# EasyEDA Pro project VTOL_V1 (3).eprj

# Schematic Schematic1
Board Name: FC-V1; Create Date: 2025-10-27; Page Name: P1; Project Name: VTOL_V1 (3); Schematic Name: Schematic1; Update Date: 2026-02-03; Company: EasyEDA.com; Page Size: A4; Version: V1.0
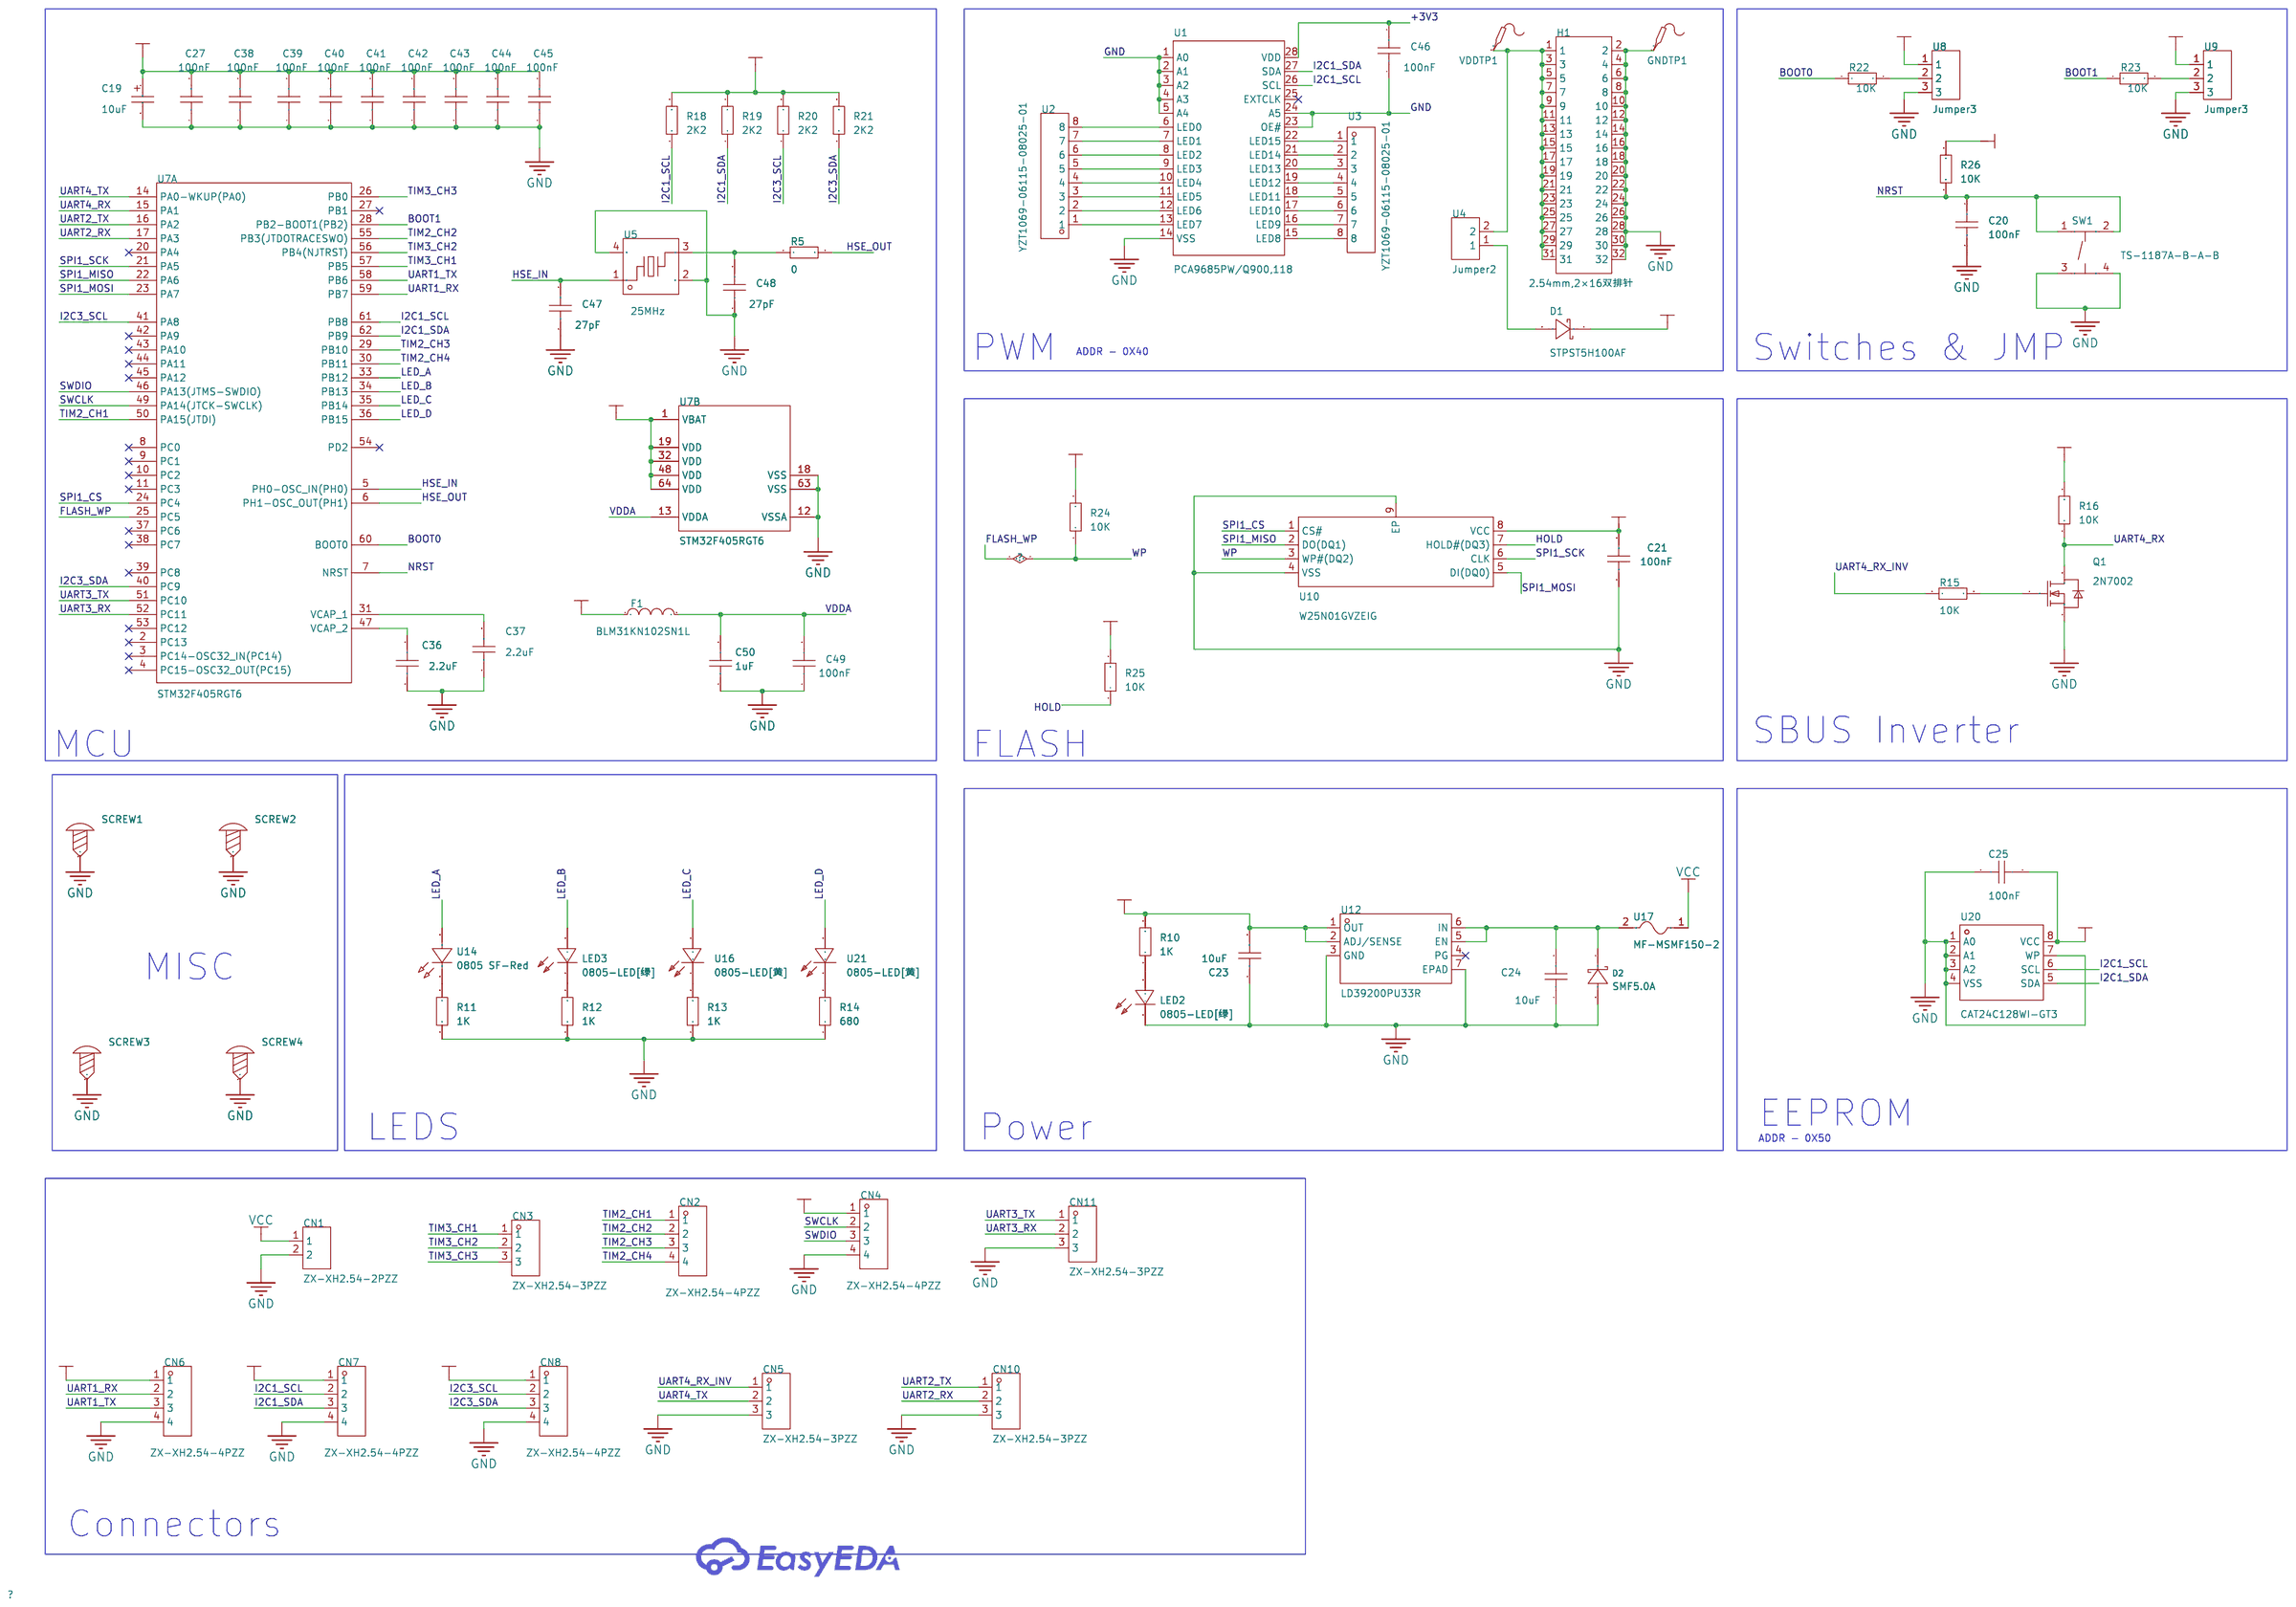
[diagram p0: schematic sheet]

## Parts
C19  10uF  [CASE-B_3528]
C20  100nF  [C0603]
C21  100nF  [C0805]
C23  10uF  [C0805]
C24  10uF  [C0805]
C25  100nF  [C0805]
C27  100nF  [C0603]
C36  2.2uF  [C0603]
C37  2.2uF  [C0603]
C38  100nF  [C0603]
C39  100nF  [C0603]
C40  100nF  [C0603]
C41  100nF  [C0603]
C42  100nF  [C0603]
C43  100nF  [C0603]
C44  100nF  [C0603]
C45  100nF  [C0603]
C46  100nF  [C0603]
C47  27pF  [C0603]
C48  27pF  [C0603]
C49  100nF  [C0603]
C50  1uF  [C0603]
CN1  ZX-XH2.54-2PZZ  [CONN-TH_2P-P2.50_HX25003-2A]
CN2  ZX-XH2.54-4PZZ  [CONN-TH_4P-P2.50_4PIN]
CN3  ZX-XH2.54-3PZZ  [CONN-TH_3P-P2.54_2501S-3P]
CN4  ZX-XH2.54-4PZZ  [CONN-TH_4P-P2.50_4PIN]
CN5  ZX-XH2.54-3PZZ  [CONN-TH_3P-P2.54_2501S-3P]
CN6  ZX-XH2.54-4PZZ  [CONN-TH_4P-P2.50_4PIN]
CN7  ZX-XH2.54-4PZZ  [CONN-TH_4P-P2.50_4PIN]
CN8  ZX-XH2.54-4PZZ  [CONN-TH_4P-P2.50_4PIN]
CN10  ZX-XH2.54-3PZZ  [CONN-TH_3P-P2.54_2501S-3P]
CN11  ZX-XH2.54-3PZZ  [CONN-TH_3P-P2.54_2501S-3P]
D1  STPST5H100AF  [SOD-128_L3.8-W2.4-LS4.7-RD]
D2  SMF5.0A  [SOD-123FL_L2.8-W1.8-LS3.7-RD]
F1  BLM31KN102SN1L  [L1206]
GNDTP1  -  [Test-Point-0.5mm]
H1  2.54mm,2×16双排针  [HDR-TH_32P-P2.54-V-M-R2-C16-S2.54]
LED2  0805-LED[绿]  [LED0805-RD_GREEN]
LED3  0805-LED[绿]  [LED0805-RD_GREEN]
Q1  2N7002  [SOT-23-3_L2.9-W1.3-P1.90-LS2.4-BR]
R5  0  [R0603]
R10  1K  [R0603]
R11  1K  [R0603]
R12  1K  [R0603]
R13  1K  [R0603]
R14  680  [R0603]
R15  10K  [R0603]
R16  10K  [R0603]
R18  2K2  [R0603]
R19  2K2  [R0603]
R20  2K2  [R0603]
R21  2K2  [R0603]
R22  10K  [R0603]
R23  10K  [R0603]
R24  10K  [R0603]
R25  10K  [R0603]
R26  10K  [R0603]
SCREW1  -  [Screw-Hole-M4]
SCREW2  -  [Screw-Hole-M4]
SCREW3  -  [Screw-Hole-M4]
SCREW4  -  [Screw-Hole-M4]
SW1  TS-1187A-B-A-B  [SW-SMD_4P-L5.1-W5.1-P3.70-LS6.5-TL_H1.5]
U1  PCA9685PW/Q900,118  [TSSOP-28_L9.7-W4.4-P0.65-LS6.4-BL]
U2  YZT1069-06115-08025-01  [HDR-TH_8P-P2.54-V-M]
U3  YZT1069-06115-08025-01  [HDR-TH_8P-P2.54-V-M]
U4  Jumper2  [HDR-TH_2P-P2.54-V-M-1]
U5  25MHz  [CRYSTAL-SMD_4P-L3.2-W2.5-BL]
U7  STM32F405RGT6  [LQFP-64_L10.0-W10.0-P0.50-LS12.0-BL]  (sections 1,2)
U8  Jumper3  [HDR-TH_3P-P2.54-V-M-A]
U9  Jumper3  [HDR-TH_3P-P2.54-V-M-A]
U10  W25N01GVZEIG  [WSON-8_L8.0-W6.10-P1.27-BL-EP]
U12  LD39200PU33R  [DFN-6_L3.0-W3.0-P0.95-BL-EP]
U14  0805 SF-Red  [LED0805-RD_RED]
U16  0805-LED[黄]  [LED0805-RD_YELLOW]
U17  MF-MSMF150-2  [F1812]
U20  CAT24C128WI-GT3  [SOIC-8_L4.9-W3.9-P1.27-LS6.0-BL]
U21  0805-LED[黄]  [LED0805-RD_YELLOW]
VDDTP1  -  [Test-Point-0.5mm]

## Library data of the parts
C19 = TAJB107K006RNJ: LCSC Part Name: 100uF ±10% 6.3V; Supplier Part: C16133; Manufacturer: Kyocera AVX; Supplier Footprint: CASE-B-3528-21(mm); JLCPCB Part Class: Basic Part; Supplier: LCSC; Tolerance: ±10%; Voltage Rating: 6.3V; Equivalent Series Resistance(ESR): 1.7Ω@100kHz; Operating Temperature: -55℃~+125℃
C20 = CAP_0603: Supplier Footprint: 0603
C21 C23-C25 = CC0805KRX7R9BB104: LCSC Part Name: 100nF ±10% 50V; Supplier Part: C49678; Manufacturer: YAGEO(国巨); Supplier Footprint: 0805; JLCPCB Part Class: Basic Part; Datasheet: https://item.szlcsc.com/datasheet/CC0805KRX7R9BB104/50686.html; Supplier: LCSC; Tolerance: ±10%; Voltage Rating: 50V; Temperature Coefficient: X7R
C27 C36-C50 = 0603B822K500CT: LCSC Part Name: 8.2nF ±10% 50V; Supplier Part: C296038; Manufacturer: Walsin(华新科); Supplier Footprint: 0603; JLCPCB Part Class: Extended Part; Datasheet: https://atta.szlcsc.com/upload/public/pdf/source/20180926/C296038_4FE3499E3C180C182923164F56DD8F14.pdf; Supplier: LCSC
CN1 = ZX-XH2.54-2PZZ: LCSC Part Name: 1x2P 间距:2.5mm 直插 系列:XH; Supplier Part: C7429632; Manufacturer: Megastar(兆星); Supplier Footprint: 插件,P=2.5mm; JLCPCB Part Class: Extended Part; Datasheet: https://item.szlcsc.com/datasheet/ZX-XH2.54-2PZZ/8427549.html; Supplier: LCSC; Pins Structure: 1x2P; Pitch: 2.5mm; Mounting Type: Through Hole; Reference Series: XH; Number of Pins: 2P; Number of Rows: 1; Number of PINs Per Row: 2; Current Rating: 2A; Contact Material: Brass; Contact Plating: Tin; Operating Temperature: -25℃~+85℃; Voltage Rating: 250V; Plastic Material: PA66; Flame Retardant Rating: UL94V-0; Color: White; Z-Height of the Board: 7mm; X-Length of Bottom Edge on Board (Spacing Line): 7.5mm; Y-Width of Bottom Edge on Board: 5.9mm
CN2 CN4 CN6-CN8 = ZX-XH2.54-4PZZ: LCSC Part Name: 1x4P 间距:2.5mm 直插 系列:XH; Supplier Part: C7429634; Manufacturer: Megastar(兆星); Supplier Footprint: 插件,P=2.5mm; JLCPCB Part Class: Extended Part; Datasheet: https://item.szlcsc.com/datasheet/ZX-XH2.54-4PZZ/8427551.html; Supplier: LCSC; Pins Structure: 1x4P; Pitch: 2.5mm; Mounting Type: Through Hole; Reference Series: XH; Number of Pins: 4P; Number of Rows: 1; Number of PINs Per Row: 4; Current Rating: 3A; Contact Material: Brass; Contact Plating: Tin; Operating Temperature: -25℃~+85℃; Voltage Rating: 250V; Plastic Material: PA66; Flame Retardant Rating: UL94V-0; Color: White; Z-Height of the Board: 7mm; X-Length of Bottom Edge on Board (Spacing Line): 12.5mm; Y-Width of Bottom Edge on Board: 5.9mm
CN3 CN5 CN10 CN11 = ZX-XH2.54-3PZZ: LCSC Part Name: 1x3P 间距:2.5mm 直插 系列:XH; Supplier Part: C7429633; Manufacturer: Megastar(兆星); Supplier Footprint: 插件,P=2.5mm; JLCPCB Part Class: Extended Part; Datasheet: https://item.szlcsc.com/datasheet/ZX-XH2.54-3PZZ/8427550.html; Supplier: LCSC; Pins Structure: 1x3P; Pitch: 2.5mm; Mounting Type: Through Hole; Reference Series: XH; Number of Pins: 3P; Number of Rows: 1; Number of PINs Per Row: 3; Current Rating: 3A; Contact Material: Brass; Contact Plating: Tin; Operating Temperature: -25℃~+85℃; Voltage Rating: 250V; Plastic Material: PA66; Flame Retardant Rating: UL94V-0; Color: White; Z-Height of the Board: 7mm; X-Length of Bottom Edge on Board (Spacing Line): 10mm; Y-Width of Bottom Edge on Board: 5.9mm
D1 = STPST5H100AF: LCSC Part Name: 电压:100V 电流:5A; Supplier Part: C20033894; Manufacturer: ST(意法半导体); Supplier Footprint: SOD-128FLAT; JLCPCB Part Class: Extended Part; Datasheet: https://item.szlcsc.com/datasheet/STPST5H100AF/21362038.html; Supplier: LCSC; Voltage - Forward(Vf@If): 680mV@5A; Voltage - DC Reverse(Vr): 100V; Current - Rectified: 5A; Reverse Leakage Current (Ir): 11.5uA@100V; Non-Repetitive Peak Forward Surge Current: 75A
D2 = SMF5.0A_C5116418: LCSC Part Name: 单向TVS 5V截止 峰值浪涌电流：21.7A@10/1000us; Supplier Part: C5116418; Manufacturer: SHIKUES(时科); Supplier Footprint: SOD-123FL; JLCPCB Part Class: Extended Part; Datasheet: https://item.szlcsc.com/datasheet/SMF5.0A/5692159.html; Supplier: LCSC; Polarity: Unidirectional; Reverse Stand-Off Voltage (Vrwm): 5V; Clamping Voltage: 9.2V; Peak Pulse Current (Ipp): 21.7A@10/1000us; Peak Pulse Power Dissipation (Ppp): 200W@10/1000us; Voltage - Breakdown: 7V; Reverse Leakage Current (Ir): 400uA; Operating Temperature: -55℃~+150℃; Type: TVS
F1 = BLM31KN102SN1L: LCSC Part Name: 单路 1206磁珠 阻抗1kΩ@100MHz; Supplier Part: C560056; Manufacturer: muRata(村田); Supplier Footprint: 1206; JLCPCB Part Class: Extended Part; Datasheet: https://atta.szlcsc.com/upload/public/pdf/source/20210621/C710520_4F6DB98DF5CB55CC9352379DA233A10A.pdf; Supplier: LCSC; Impedance @ Frequency: 1kΩ@100MHz; DC Resistance: 75mΩ; Current Rating: 2A; Circuits: 1
GNDTP1 VDDTP1 = Test-Point
H1 = 2.54mm,2×16双排针: LCSC Part Name: 2x16P 间距:2.54mm 方针 直插; Supplier Part: C24328; Manufacturer: BOOMELE(博穆精密); Supplier Footprint: 插件,P=2.54mm; JLCPCB Part Class: Extended Part; Datasheet: https://item.szlcsc.com/datasheet/2.54mm%252C2%25C3%259716%25E5%258F%258C%25E6%258E%2592%25E9%2592%2588/25068.html; Supplier: LCSC; Pin Structure: 2x16P; Pitch: 2.54mm; Row Spacing: 2.54mm; Circluar Pins/Square Pins: Pin Header; Mounting Type: Through Hole; Number of Rows: 2; Number of Pins: 32P; Current Rating: 3A; Voltage Rating (Max): 250V; Operating Temperature: -25℃~+85℃; Color: Black
LED2 LED3 = 0805-LED[绿]: Supplier Part: C9900003727; JLCPCB Part Class: Extended Part; Supplier: LCSC
Q1 = 2N7002_C51315010: Supplier Part: C51315010; Manufacturer: CBI(创基); Supplier Footprint: SOT-23; JLCPCB Part Class: Extended Part; Datasheet: https://item.szlcsc.com/datasheet/2N7002/53967148.html; Supplier: LCSC
R5 R10-R16 R22-R26 = Res_0603: Supplier Footprint: 0603
R18-R21 = RT0603FRD07100RL: LCSC Part Name: 薄膜电阻 100Ω ±1% 100mW; Supplier Part: C160603; Manufacturer: YAGEO(国巨); Supplier Footprint: 0603; JLCPCB Part Class: Extended Part; Datasheet: https://atta.szlcsc.com/upload/public/pdf/source/20181009/C309664_C7CEF5A7F4D0541F96EF5E54D941D229.pdf; Supplier: LCSC; Type: Thin Film Resistor; Tolerance: ±1%; Temperature Coefficient: ±25ppm/℃; Operating Temperature Range: -55℃~+155℃
SCREW1-SCREW4 = Screw-Hole-M4: Supplier Footprint: 插件
SW1 = TS-1187A-B-A-B: LCSC Part Name: 5.1*5.1*1.5mm 立贴 轻触开关; Supplier Part: C318884; Manufacturer: XKB Connection(中国星坤); Supplier Footprint: SMD; JLCPCB Part Class: Basic Part; Datasheet: https://item.szlcsc.com/datasheet/TS-1187A-B-A-B/299976.html; Supplier: LCSC; Circuit: SPST; Actuator Style: Round Button; Operating Force: 1.6N; Mounting Type: Surface Mount,Vertical; Length: 5.1mm; Width: 5.1mm; Switch Height: 1.5mm; with Bracket: Without Bracket; Contact Current: 50mA; Voltage Rating: 12V; Actuator/Cap Color: Gold; With Lamp: No; Life: 100,000 Cycles; Operating Temperature: -30℃~+85℃
U1 = PCA9685PW/Q900,118: Supplier Part: C92206; Manufacturer: NXP(恩智浦); Supplier Footprint: TSSOP-28; JLCPCB Part Class: Extended Part; Datasheet: https://www.nxp.com.cn/docs/en/data-sheet/PCA9685.pdf; Supplier: LCSC; Voltage - Input(DC): 2.3V~5.5V; Number of Channels: 16; Output Voltage: 5.5V; Output Current: 25mA; Dimming: PWM; Operating temperature: -40℃~+85℃
U2 U3 = YZT1069-06115-08025-01: LCSC Part Name: 1x8P 间距:2.54mm 方针 直插; Supplier Part: C22368217; Manufacturer: Xinyangze(鑫扬泽); Supplier Footprint: 插件,P=2.54mm; JLCPCB Part Class: Extended Part; Datasheet: https://item.szlcsc.com/datasheet/YZT1069-06115-08025-01/23843844.html; Supplier: LCSC; Pin Structure: 1x8P; Pitch: 2.54mm; Circluar Pins/Square Pins: Pin Header; Mounting Type: Through Hole; Number of Rows: 1; Number of Pins: 8P; Current Rating: 3A; Length of Mating Pin: 6mm; Insulation Height: 2.54mm; Length of End Connection Pin: 3mm; Contact Material: Copper Alloy; Contact Plating: Gold; Operating Temperature: -25℃~+105℃
U4 = Jumper2: Supplier Part: C2940092; Supplier Footprint: HDR-TH-2P-2.54mm; JLCPCB Part Class: Extended Part; Supplier: LCSC
U5 = XXACBCNANF-25MHZ: LCSC Part Name: 25MHz ±20ppm 8pF; Supplier Part: C5382669; Manufacturer: TAITIEN(泰艺电子); Supplier Footprint: SMD3225-4P; JLCPCB Part Class: Extended Part; Supplier: LCSC; Type: Surface Mount Crystal; Normal temperature Frequency Tolerance: ±20ppm; Frequency Stability: ±20ppm; Operating Temperature: -20℃~+70℃
U7 = STM32F405RGT6: LCSC Part Name: 带DSP和FPU的高性能基础系列ARM Cortex-M4 MCU，具有1 MB Flash、168 MHz CPU和ART加速器; Supplier Part: C15742; Manufacturer: ST(意法半导体); Supplier Footprint: LQFP-64(10x10); JLCPCB Part Class: Extended Part; Datasheet: https://item.szlcsc.com/datasheet/STM32F405RGT6/16424.html; Supplier: LCSC; CPU Core: ARM-M4; CPU Maximum Speed: 168MHz; Program Storage Size: 1MB; Program Memory Type: FLASH; Number of I/O: 51; ADC (Bit): 12bit; DAC (Bit): 12bit; Voltage - Supply: 1.8V~3.6V
U8 U9 = Jumper3: Supplier Part: C2940050; Supplier Footprint: HDR-TH-3P-2.54mm; JLCPCB Part Class: Extended Part; Supplier: LCSC
U10 = W25N01GVZEIG: LCSC Part Name: 具备双/四路SPI缓冲读取和连续读取功能的3V、1Gb串行SLCNAND闪存; Supplier Part: C907680; Manufacturer: Winbond(华邦); Supplier Footprint: WSON-8-EP(6.1x8); JLCPCB Part Class: Extended Part; Datasheet: https://item.szlcsc.com/datasheet/W25N01GVZEIG/973560.html; Supplier: LCSC; Memory Size: 1Gbit; Interface: SPI; Clock Frequency: 104MHz; Voltage - Supply: 2.7V~3.6V; Page Program time (TPP): 250us; Block Erase Time(tBE): 2ms; Data Retention - TDR (Year): 10 Years; Operating Temperature: -40℃~+85℃
U12 = LD39200PU33R: LCSC Part Name: 具有反向电流保护的2 A高PSRR超低压降线性稳压器; Supplier Part: C222192; Manufacturer: ST(意法半导体); Supplier Footprint: DFN-6(3x3); JLCPCB Part Class: Extended Part; Datasheet: https://item.szlcsc.com/datasheet/LD39200PU33R/222573.html; Supplier: LCSC; Output Type: Fixed; Voltage - Supply: 6V; Output Voltage: 3.3V; Output Current: 2A; Power Supply Rejection Ratio (PSRR): 70dB@(1kHz); Voltage Dropout: 130mV@(2A); standby current: 100uA; Noise: 40uVrms; Features: Thermal Shutdown；PG Pin；Short Circuit Protection；Reverse Polarity Protection; Operating Temperature: -40℃~+125℃@(Tj); Output Configuration: Positive; Number of Outputs: 1
U14 = 0805 SF-Red: Supplier Part: C9900020303; Supplier Footprint: LED0805RD_RED; JLCPCB Part Class: Extended Part; Supplier: LCSC
U16 U21 = 0805-LED[黄]: Supplier Part: C9900003713; Supplier Footprint: LED0805-RD-YELLOW; JLCPCB Part Class: Extended Part; Supplier: LCSC
U17 = MF-MSMF150-2: LCSC Part Name: 6V 1.5A 1812自恢复; Supplier Part: C89648; Manufacturer: BOURNS; Supplier Footprint: 1812; JLCPCB Part Class: Extended Part; Datasheet: https://item.szlcsc.com/datasheet/MF-MSMF150-2/90828.html; Supplier: LCSC; Voltage - Max: 6V; Current - Max: 100A; Power Dissipation: 800mW; Resistance - Initial (Ri) (Min): 30mΩ; Resistance - Post Trip (R1) (Max): 120mΩ; Operating Temperature: -40℃~+85℃; Length: 5.4mm; Width: 3.2mm
U20 = CAT24C128WI-GT3: Supplier Part: C81195; Manufacturer: onsemi(安森美); Supplier Footprint: SOIC-8; JLCPCB Part Class: Extended Part; Datasheet: https://item.szlcsc.com/datasheet/CAT24C128WI-GT3/82345.html; Supplier: LCSC; Interface: I2C; Memory Size: 128Kbit; Clock Frequency: 1MHz; Voltage - Supply: 1.8V~5.5V; Write Cycle Time(Tw): 5ms; Data Retention - TDR (Year): 100 Years; Write Cycle Endurance: 1,000,000 Cycles; Operating Temperature: -40℃~+85℃

## Nets
+3V3: C19.1 C21.2 C23.2 C25.1 C27.2 C38.2 C39.2 C40.2 C41.2 C42.2 C43.2 C44.2 C45.2 C46.2 CN4.1 CN6.1 CN7.1 CN8.1 F1.1 R10.2 R16.2 R18.2 R19.2 R20.2 R21.2 R24.2 R25.2 R26.2 U1.28(VDD) U7.1(VBAT) U7.19(VDD) U7.32(VDD) U7.48(VDD) U7.64(VDD) U8.1 U9.1 U10.8(VCC) U12.1(OUT) U12.2(ADJ/SENSE) U20.8(VCC)
GND: C19.2 C20.2 C21.1 C23.1 C24.1 C25.2 C27.1 C36.1 C37.1 C38.1 C39.1 C40.1 C41.1 C42.1 C43.1 C44.1 C45.1 C46.1 C47.1 C48.1 C49.1 C50.1 CN1.2 CN4.4 CN5.3 CN6.4 CN7.4 CN8.4 CN10.3 CN11.3 D2.2(A) GNDTP1.1 H1.2 H1.4 H1.6 H1.8 H1.10 H1.12 H1.14 H1.16 H1.18 H1.20 H1.22 H1.24 H1.26 H1.28 H1.30 H1.32 LED2.1(-) Q1.2(S) R11.1 R12.1 R13.1 R14.1 SCREW1.1 SCREW2.1 SCREW3.1 SCREW4.1 SW1.3(C) SW1.4(D) U1.1(A0) U1.2(A1) U1.3(A2) U1.4(A3) U1.5(A4) U1.14(VSS) U1.23(OE#) U1.24(A5) U5.2(GND) U5.4(GND) U7.12(VSSA) U7.18(VSS) U7.63(VSS) U8.3 U9.3 U10.4(VSS) U10.9(EP) U12.3(GND) U12.7(EPAD) U20.1(A0) U20.2(A1) U20.3(A2) U20.4(VSS) U20.7(WP)
VCC: CN1.1 U17.1
VDDA: C49.2 C50.2 F1.2 U7.13(VDDA)
BOOT0: R22.1 U7.60(BOOT0)
BOOT1: R23.1 U7.28(PB2-BOOT1(PB2))
FLASH_WP: R24.1 U7.25(PC5) U10.3(WP#(DQ2))
HOLD: R25.1 U10.7(HOLD#(DQ3))
HSE_IN: C47.2 U5.1 U7.5(PH0-OSC_IN(PH0))
HSE_OUT: R5.2 U7.6(PH1-OSC_OUT(PH1))
I2C1_SCL: CN7.2 R18.1 U1.26(SCL) U7.61(PB8) U20.6(SCL)
I2C1_SDA: CN7.3 R19.1 U1.27(SDA) U7.62(PB9) U20.5(SDA)
I2C3_SCL: CN8.2 R20.1 U7.41(PA8)
I2C3_SDA: CN8.3 R21.1 U7.40(PC9)
LED_A: U7.33(PB12) U14.2(A)
LED_B: LED3.2(+) U7.34(PB13)
LED_C: U7.35(PB14) U16.2
LED_D: U7.36(PB15) U21.2
NRST: C20.1 R26.1 SW1.1(A) SW1.2(B) U7.7(NRST)
SPI1_CS: U7.24(PC4) U10.1(CS#)
SPI1_MISO: U7.22(PA6) U10.2(DO(DQ1))
SPI1_MOSI: U7.23(PA7) U10.5(DI(DQ0))
SPI1_SCK: U7.21(PA5) U10.6(CLK)
SWCLK: CN4.2 U7.49(PA14(JTCK-SWCLK))
SWDIO: CN4.3 U7.46(PA13(JTMS-SWDIO))
TIM2_CH1: CN2.1 U7.50(PA15(JTDI))
TIM2_CH2: CN2.2 U7.55(PB3(JTDOTRACESWO))
TIM2_CH3: CN2.3 U7.29(PB10)
TIM2_CH4: CN2.4 U7.30(PB11)
TIM3_CH1: CN3.1 U7.57(PB5)
TIM3_CH2: CN3.2 U7.56(PB4(NJTRST))
TIM3_CH3: CN3.3 U7.26(PB0)
UART1_RX: CN6.2 U7.59(PB7)
UART1_TX: CN6.3 U7.58(PB6)
UART2_RX: CN10.2 U7.17(PA3)
UART2_TX: CN10.1 U7.16(PA2)
UART3_RX: CN11.2 U7.52(PC11)
UART3_TX: CN11.1 U7.51(PC10)
UART4_RX: Q1.3(D) R16.1 U7.15(PA1)
UART4_RX_INV: CN5.1 R15.1
UART4_TX: CN5.2 U7.14(PA0-WKUP(PA0))
V_SERVO: D1.1(K)
$1N899: C37.2 U7.31(VCAP_1)
$1N903: C36.2 U7.47(VCAP_2)
$1N2019: C48.2 R5.1 U5.3
$1N4024: U1.6(LED0) U2.8
$1N4028: U1.7(LED1) U2.7
$1N4033: U1.8(LED2) U2.6
$1N4038: U1.9(LED3) U2.5
$1N4043: U1.10(LED4) U2.4
$1N4048: U1.11(LED5) U2.3
$1N4053: U1.12(LED6) U2.2
$1N4058: U1.13(LED7) U2.1
$1N4529: U1.22(LED15) U3.1
$1N4533: U1.21(LED14) U3.2
$1N4538: U1.20(LED13) U3.3
$1N4543: U1.19(LED12) U3.4
$1N4548: U1.18(LED11) U3.5
$1N4553: U1.17(LED10) U3.6
$1N4558: U1.16(LED9) U3.7
$1N4563: U1.15(LED8) U3.8
$1N4838: H1.1 H1.3 H1.5 H1.7 H1.9 H1.11 H1.13 H1.15 H1.17 H1.19 H1.21 H1.23 H1.25 H1.27 H1.29 H1.31 U4.2 VDDTP1.1
$1N5034: D1.2(A) U4.1
$1N9057: R22.2 U8.2
$1N9157: R23.2 U9.2
$1N10282: C24.2 D2.1(K) U12.5(EN) U12.6(IN) U17.2
$1N11945: LED2.2(+) R10.1
$1N12544: R11.2 U14.1(K)
$1N12570: LED3.1(-) R12.2
$1N12596: R13.2 U16.1
$1N29425: Q1.1(G) R15.2
$1N35593: R14.2 U21.1

Not connected (* = marked no-connect by the designer): U1 25(EXTCLK)*; U7 2(PC13)* 3(PC14-OSC32_IN(PC14))* 4(PC15-OSC32_OUT(PC15))* 8(PC0)* 9(PC1)* 10(PC2)* 11(PC3)* 20(PA4)* 27(PB1)* 37(PC6)* 38(PC7)* 39(PC8)* 42(PA9)* 43(PA10)* 44(PA11)* 45(PA12)* 53(PC12)* 54(PD2)*; U12 4(PG)*

## Notes on the sheet
- ADDR - 0X40
- PWM
- Switches & JMP
- SBUS Inverter
- MCU
- FLASH
- MISC
- EEPROM
- LEDS
- Power
- ADDR - 0X50
- Connectors

# Board PCB1
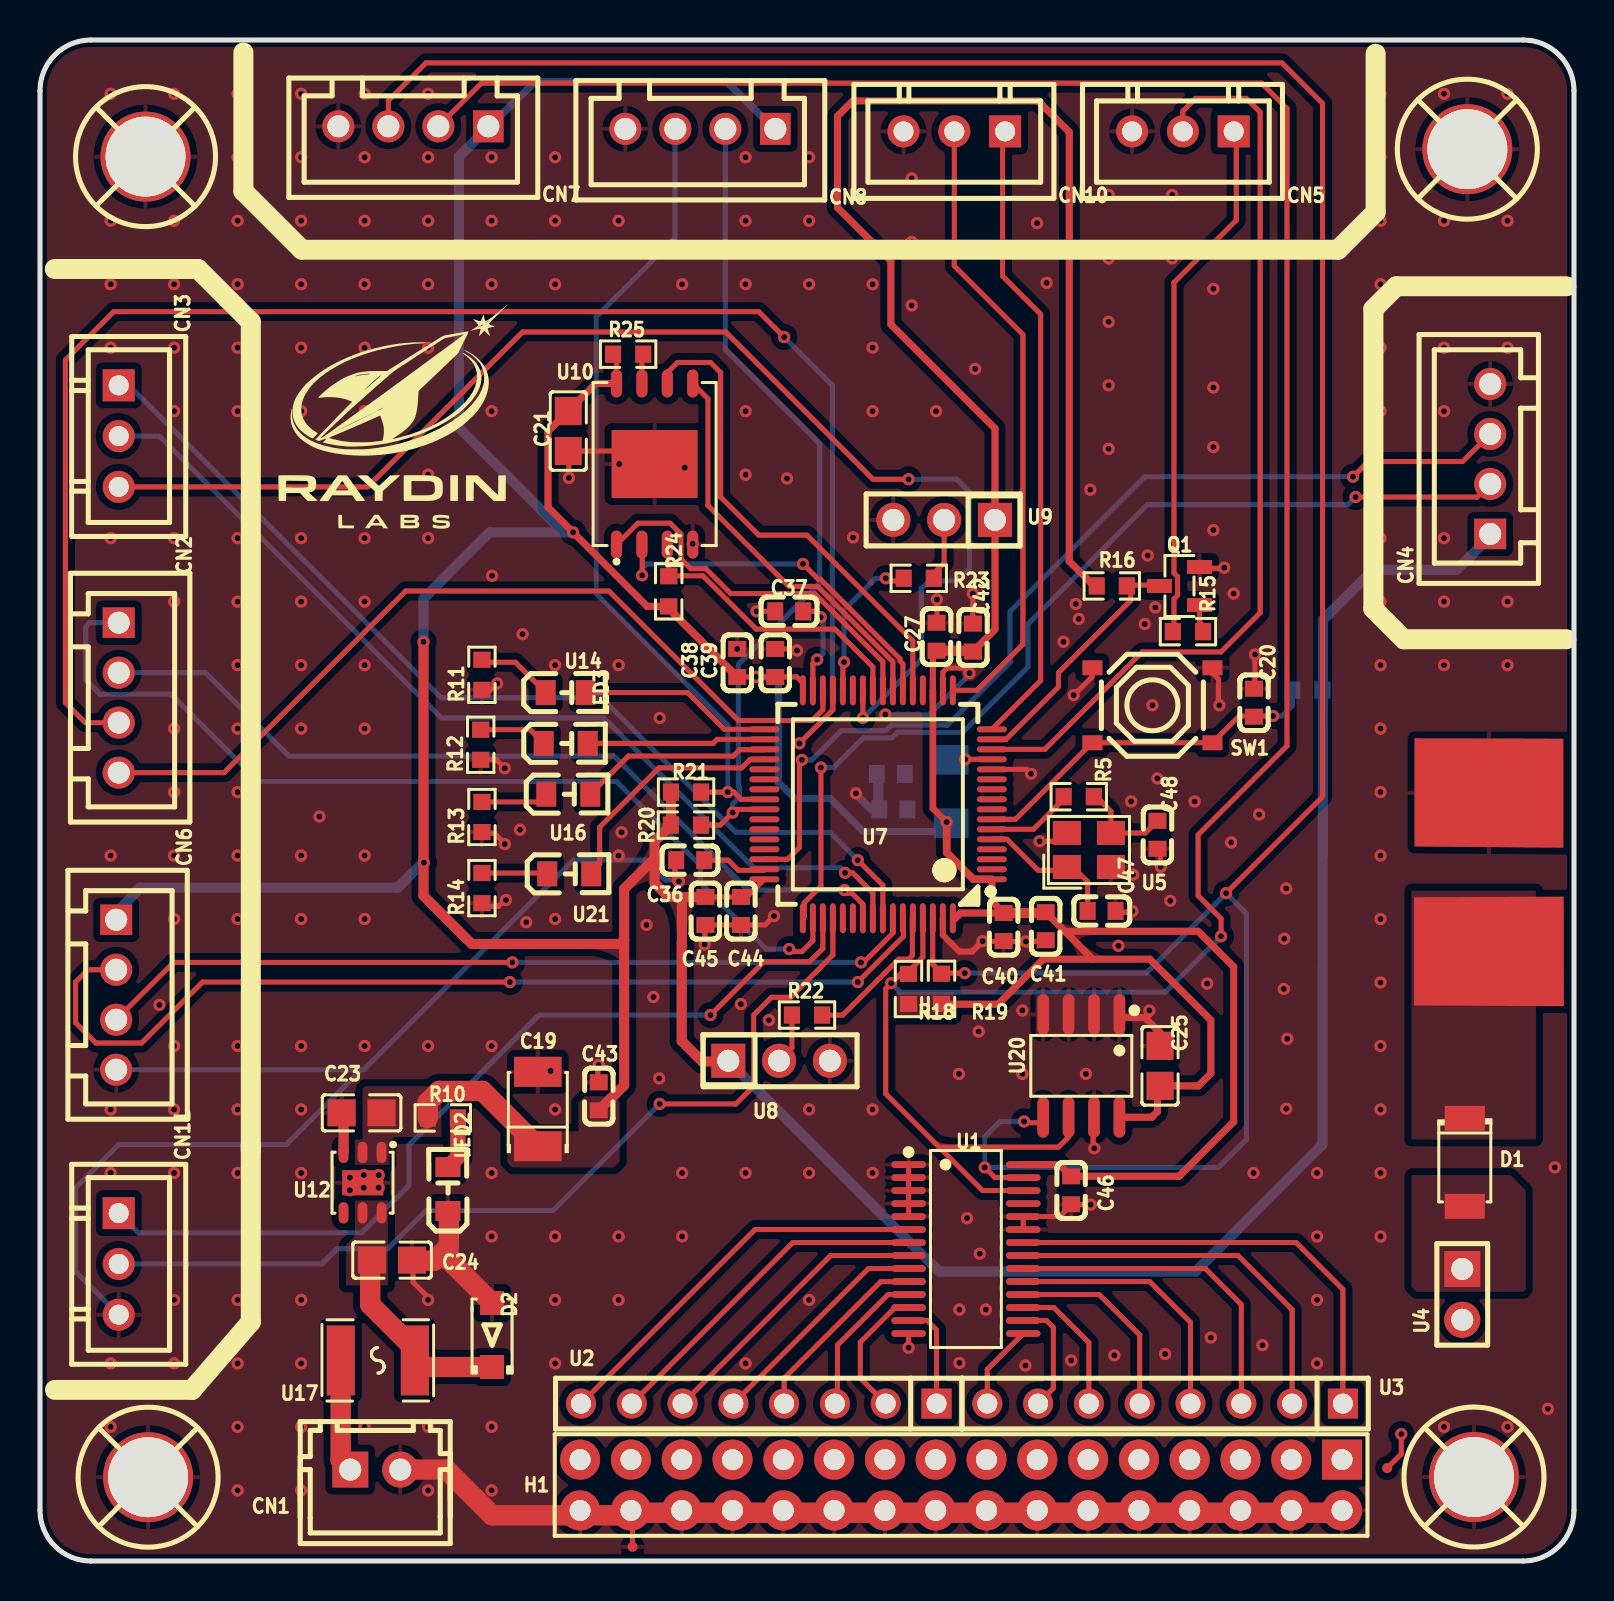
[diagram p1: board, top side]
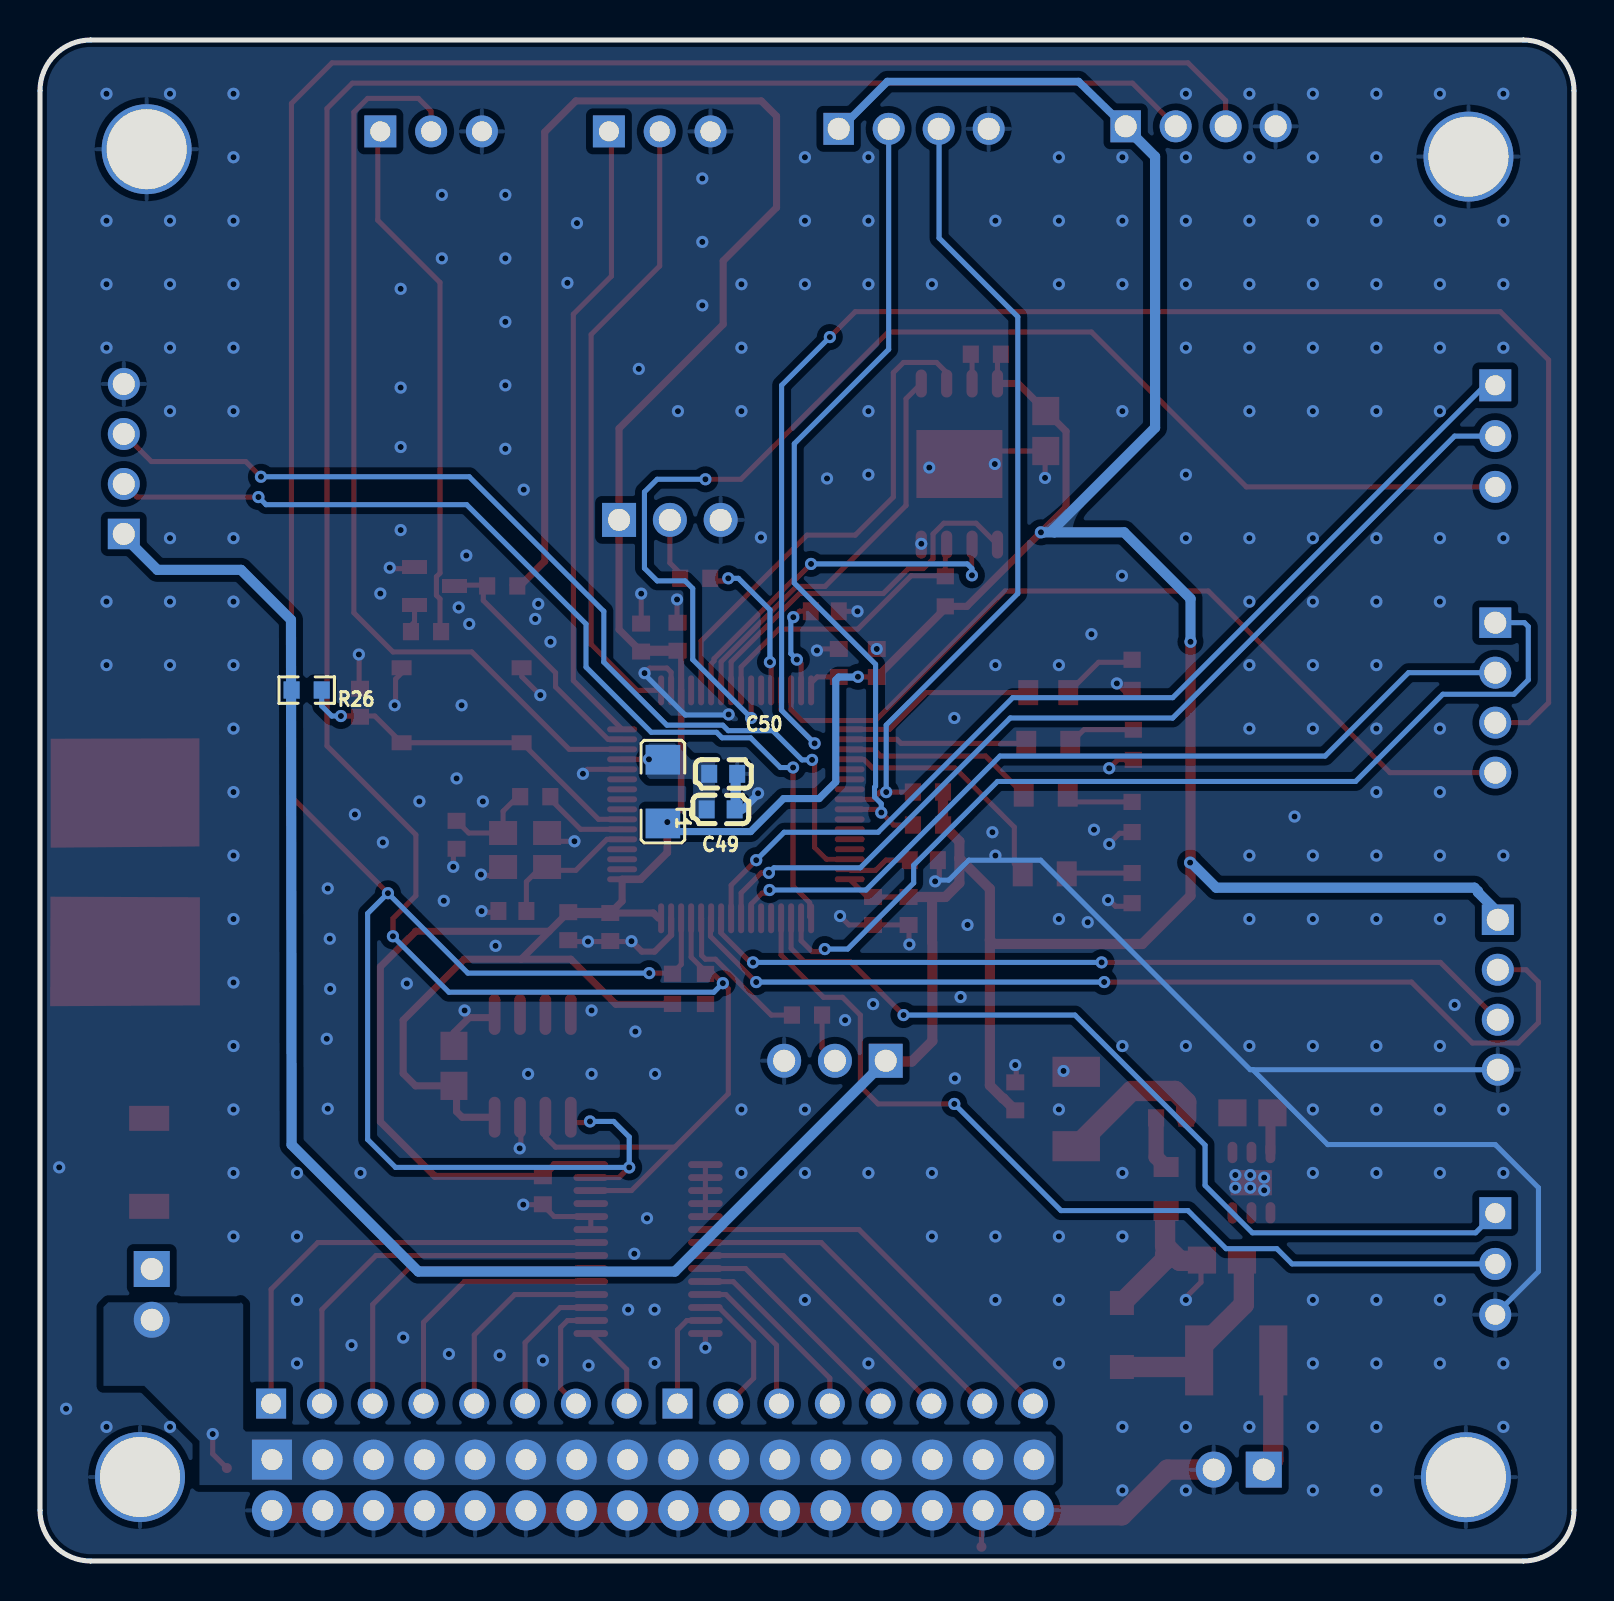
[diagram p2: board, bottom side, seen from below]

Outline 76.71 x 76.07 mm; copper layers: Top Layer, Bottom Layer. Coordinates in mm from the lower left corner of the outline.
Outline path: 0,73.53 0,2.54 arc(0.74,0.74) 2.54,0 74.17,0 arc(75.96,0.74) 76.71,2.54 76.71,73.53 arc(75.96,75.33) 74.17,76.07 2.54,76.07 arc(0.74,75.33) 0,73.53
Stack: Top Layer 0.035mm / Dielectric1 1.51mm FR4 er 4.5 / Bottom Layer 0.035mm

## Design rules (mm)
template: JLCPCB Capability(Two Layers Board)
spacing copperThickness1oz (default): track to track 0.102, other pairs 0.152 to 0.3
spacing copperThickness2oz: track to track 0.203, other pairs 0.152 to 0.3
track width copperThickness1oz (default): min 0.127, default 0.254, max 2.54
track width copperThickness2oz: min 0.203, default 0.254, max 2.54
differential pair differentialPair (default): width min 0.127, default 0.254, max 2.54; gap min 0.152, default 0.152
via viaSize (default): diameter min 0.5, default 0.61, max 10; hole min 0.3, default 0.305, max 6.3
pour e1160 uses copperRegion

## Placement (name value [footprint] x y rotation side)
C19  10uF  [CASE-B_3528]  24.89 22.61 90 top
C20  100nF  [C0603]  60.71 42.93 90 top
C21  100nF  [C0805]  26.42 56.52 90 top
C23  10uF  [C0805]  16.08 22.42 0 top
C24  10uF  [C0805]  17.6 15.05 180 top
C25  100nF  [C0805]  56.01 24.77 90 top
C27  100nF  [C0603]  44.83 46.23 270 top
C36  2.2uF  [C0603]  32.51 35.05 0 top
C37  2.2uF  [C0603]  37.46 47.5 0 top
C38  100nF  [C0603]  34.87 44.92 270 top
C39  100nF  [C0603]  36.76 44.92 270 top
C40  100nF  [C0603]  48.19 31.71 90 top
C41  100nF  [C0603]  50.29 31.75 90 top
C42  100nF  [C0603]  46.65 46.19 270 top
C43  100nF  [C0603]  27.94 23.24 270 top
C44  100nF  [C0603]  35.05 32.51 90 top
C45  100nF  [C0603]  33.27 32.51 90 top
C46  100nF  [C0603]  51.56 18.54 90 top
C47  27pF  [C0603]  53.09 32.51 180 top
C48  27pF  [C0603]  55.88 36.32 90 top
C49  100nF  [C0603]  42.67 37.59 0 bottom
C50  1uF  [C0603]  42.55 39.37 0 bottom
CN1  ZX-XH2.54-2PZZ  [CONN-TH_2P-P2.50_HX25003-2A]  16.76 4.57 0 top
CN2  ZX-XH2.54-4PZZ  [CONN-TH_4P-P2.50_4PIN]  3.94 43.18 270 top
CN3  ZX-XH2.54-3PZZ  [CONN-TH_3P-P2.54_2501S-3P]  3.94 56.26 270 top
CN4  ZX-XH2.54-4PZZ  [CONN-TH_4P-P2.50_4PIN]  72.52 55.12 90 top
CN5  ZX-XH2.54-3PZZ  [CONN-TH_3P-P2.54_2501S-3P]  57.15 71.5 180 top
CN6  ZX-XH2.54-4PZZ  [CONN-TH_4P-P2.50_4PIN]  3.81 28.32 270 top
CN7  ZX-XH2.54-4PZZ  [CONN-TH_4P-P2.50_4PIN]  18.67 71.76 180 top
CN8  ZX-XH2.54-4PZZ  [CONN-TH_4P-P2.50_4PIN]  33.02 71.63 180 top
CN10  ZX-XH2.54-3PZZ  [CONN-TH_3P-P2.54_2501S-3P]  45.72 71.5 180 top
CN11  ZX-XH2.54-3PZZ  [CONN-TH_3P-P2.54_2501S-3P]  3.94 14.86 270 top
D1  STPST5H100AF  [SOD-128_L3.8-W2.4-LS4.7-RD]  71.25 19.94 270 top
D2  SMF5.0A  [SOD-123FL_L2.8-W1.8-LS3.7-RD]  22.61 11.3 90 top
F1  BLM31KN102SN1L  [L1206]  45.56 38.48 90 bottom
GNDTP1  -  [Test-Point-0.5mm]  29.63 0.71 90 top
H1  2.54mm,2×16双排针  [HDR-TH_32P-P2.54-V-M-R2-C16-S2.54]  46.06 3.8 180 top
LED2  0805-LED[绿]  [LED0805-RD_GREEN]  20.4 18.61 90 top
LED3  0805-LED[绿]  [LED0805-RD_GREEN]  26.29 40.89 0 top
NOREF  -  [Pad_e5354]  72.45 30.49 0 top
NOREF#2  -  [Pad_e5994]  16.14 18.92 0 top
NOREF#3  -  [Pad_e5947]  72.45 38.42 0 top
Q1  2N7002  [SOT-23-3_L2.9-W1.3-P1.90-LS2.4-BR]  56.98 48.76 0 top
R5  0  [R0603]  51.94 38.23 180 top
R10  1K  [R0603]  20.14 22.16 180 top
R11  1K  [R0603]  22.1 44.32 90 top
R12  1K  [R0603]  22.04 40.83 90 top
R13  1K  [R0603]  22.1 37.21 90 top
R14  680  [R0603]  22.1 33.66 90 top
R15  10K  [R0603]  57.4 46.48 0 top
R16  10K  [R0603]  53.59 48.77 180 top
R18  2K2  [R0603]  43.43 28.61 270 top
R19  2K2  [R0603]  45.08 28.62 270 top
R20  2K2  [R0603]  32.3 36.81 180 top
R21  2K2  [R0603]  32.31 38.46 180 top
R22  10K  [R0603]  38.35 27.31 180 top
R23  10K  [R0603]  43.94 49.15 0 top
R24  10K  [R0603]  31.44 48.5 270 top
R25  10K  [R0603]  29.41 60.36 180 top
R26  10K  [R0603]  63.37 43.56 0 bottom
SCREW1  -  [Screw-Hole-M4]  5.28 70.24 0 top
SCREW2  -  [Screw-Hole-M4]  71.71 4.2 0 top
SCREW3  -  [Screw-Hole-M4]  5.41 4.19 0 top
SCREW4  -  [Screw-Hole-M4]  71.37 70.61 0 top
SW1  TS-1187A-B-A-B  [SW-SMD_4P-L5.1-W5.1-P3.70-LS6.5-TL_H1.5]  55.63 42.8 180 top
U1  PCA9685PW/Q900,118  [TSSOP-28_L9.7-W4.4-P0.65-LS6.4-BL]  46.3 15.6 270 top
U2  YZT1069-06115-08025-01  [HDR-TH_8P-P2.54-V-M]  35.94 7.87 180 top
U3  YZT1069-06115-08025-01  [HDR-TH_8P-P2.54-V-M]  56.26 7.87 180 top
U4  Jumper2  [HDR-TH_2P-P2.54-V-M-1]  71.12 13.34 270 top
U5  25MHz  [CRYSTAL-SMD_4P-L3.2-W2.5-BL]  52.45 35.56 0 top
U7  STM32F405RGT6  [LQFP-64_L10.0-W10.0-P0.50-LS12.0-BL]  41.91 37.85 90 top
U8  Jumper3  [HDR-TH_3P-P2.54-V-M-A]  36.96 25.02 0 top
U9  Jumper3  [HDR-TH_3P-P2.54-V-M-A]  45.21 52.07 180 top
U10  W25N01GVZEIG  [WSON-8_L8.0-W6.10-P1.27-BL-EP]  30.73 54.86 0 top
U12  LD39200PU33R  [DFN-6_L3.0-W3.0-P0.95-BL-EP]  16.13 18.92 180 top
U14  0805 SF-Red  [LED0805-RD_RED]  26.29 43.43 0 top
U16  0805-LED[黄]  [LED0805-RD_YELLOW]  26.42 38.35 0 top
U17  MF-MSMF150-2  [F1812]  16.89 10.03 0 top
U20  CAT24C128WI-GT3  [SOIC-8_L4.9-W3.9-P1.27-LS6.0-BL]  52.07 24.77 180 top
U21  0805-LED[黄]  [LED0805-RD_YELLOW]  26.47 34.37 0 top
VDDTP1  -  [Test-Point-0.5mm]  67.36 4.65 0 top

## Footprints (pads in the part's own frame, mm; a bottom-side part is the same pattern mirrored in y, then rotated)
C0603
  rect 0.8x0.9 smd: 1(-0.7,0) 2(0.7,0)
C0805
  rect 1.41x1.35 smd: 1(-1,0) 2(1,0)
CASE-B_3528
  rect 1.506x2.376 smd: 1(-1.861,0) 2(1.861,0)
CONN-TH_2P-P2.50_HX25003-2A
  rect 1.8x1.8 hole 1.1: 1(-1.25,0)
  round 1.8 hole 1.1: 2(1.25,0)
CONN-TH_3P-P2.54_2501S-3P
  rect 1.6x1.6 hole 1: 1(-2.54,0)
  round 1.6 hole 1: 2(0,0) 3(2.54,0)
CONN-TH_4P-P2.50_4PIN
  rect 1.524x1.6 hole 1.1: 1(-3.75,0)
  round 1.6 hole 1.1: 2(-1.25,0) 3(1.25,0) 4(3.75,0)
CRYSTAL-SMD_4P-L3.2-W2.5-BL
  rect 1.4x1.2 smd: 1(-1.1,-0.85) 2(1.1,-0.85) 3(1.1,0.85) 4(-1.1,0.85)
DFN-6_L3.0-W3.0-P0.95-BL-EP
  oval 0.49x1.07 smd: 1(-0.95,-1.51) 2(0,-1.51) 3(0.95,-1.51) 4(0.95,1.51) 5(0,1.51) 6(-0.95,1.51)
  rect 2x1.2 smd: 7(0,0)
F1812
  rect 1.407x3.499 smd: 1(-1.853,0) 2(1.853,0)
HDR-TH_2P-P2.54-V-M-1
  rect 1.8x1.8 hole 1.1: 1(-1.27,0)
  round 1.8 hole 1.1: 2(1.27,0)
HDR-TH_3P-P2.54-V-M-A
  rect 1.7x1.7 hole 1.1: 1(-2.54,0)
  round 1.7 hole 1.1: 2(0,0) 3(2.54,0)
HDR-TH_8P-P2.54-V-M
  rect 1.5x1.5 hole 1: 1(-8.89,0)
  round 1.5 hole 1: 2(-6.35,0) 3(-3.81,0) 4(-1.27,0) 5(1.27,0) 6(3.81,0) 7(6.35,0) 8(8.89,0)
HDR-TH_32P-P2.54-V-M-R2-C16-S2.54
  rect 2x2 hole 1.05: 1(-19.05,-1.27)
  round 2 hole 1.05: 2(-19.05,1.27) 3(-16.51,-1.27) 4(-16.51,1.27) 5(-13.97,-1.27) 6(-13.97,1.27) 7(-11.43,-1.27) 8(-11.43,1.27) 9(-8.89,-1.27) 10(-8.89,1.27) 11(-6.35,-1.27) 12(-6.35,1.27) 13(-3.81,-1.27) 14(-3.81,1.27) 15(-1.27,-1.27) 16(-1.27,1.27) 17(1.27,-1.27) 18(1.27,1.27) 19(3.81,-1.27) 20(3.81,1.27) 21(6.35,-1.27) 22(6.35,1.27) 23(8.89,-1.27) 24(8.89,1.27) 25(11.43,-1.27) 26(11.43,1.27) 27(13.97,-1.27) 28(13.97,1.27) 29(16.51,-1.27) 30(16.51,1.27) 31(19.05,-1.27) 32(19.05,1.27)
L1206
  rect 1.485x1.728 smd: 1(-1.593,0) 2(1.593,0)
LED0805-RD_GREEN
  rect 1x1.25 smd: 1(-1.1,0) 2(1.1,0)
LED0805-RD_RED
  rect 1x1.25 smd: 1(-1,0) 2(1,0)
LED0805-RD_YELLOW
  rect 1x1.25 smd: 1(-1.1,0) 2(1.1,0)
LQFP-64_L10.0-W10.0-P0.50-LS12.0-BL
  oval 0.3x1.5 smd: 1(-3.75,-5.688) 2(-3.25,-5.688) 3(-2.75,-5.688) 4(-2.25,-5.688) 5(-1.75,-5.688) 6(-1.25,-5.688) 7(-0.75,-5.688) 8(-0.25,-5.688) 9(0.25,-5.688) 10(0.75,-5.688) 11(1.25,-5.688) 12(1.75,-5.688) 13(2.25,-5.688) 14(2.75,-5.688) 15(3.25,-5.688) 16(3.75,-5.688) 33(3.75,5.688) 34(3.25,5.688) 35(2.75,5.688) 36(2.25,5.688) 37(1.75,5.688) 38(1.25,5.688) 39(0.75,5.688) 40(0.25,5.688) 41(-0.25,5.688) 42(-0.75,5.688) 43(-1.25,5.688) 44(-1.75,5.688) 45(-2.25,5.688) 46(-2.75,5.688) 47(-3.25,5.688) 48(-3.75,5.688)
  oval 1.5x0.3 smd: 17(5.7,-3.738) 18(5.7,-3.238) 19(5.7,-2.738) 20(5.7,-2.238) 21(5.7,-1.738) 22(5.7,-1.238) 23(5.7,-0.739) 24(5.7,-0.238) 25(5.7,0.262) 26(5.7,0.762) 27(5.7,1.262) 28(5.7,1.762) 29(5.7,2.261) 30(5.7,2.762) 31(5.7,3.261) 32(5.7,3.762) 49(-5.7,3.762) 50(-5.7,3.261) 51(-5.7,2.762) 52(-5.7,2.261) 53(-5.7,1.762) 54(-5.7,1.262) 55(-5.7,0.762) 56(-5.7,0.262) 57(-5.7,-0.238) 58(-5.7,-0.739) 59(-5.7,-1.238) 60(-5.7,-1.738) 61(-5.7,-2.238) 62(-5.7,-2.738) 63(-5.7,-3.238) 64(-5.7,-3.738)
Pad_e5354
  custom 7.488x5.477 smd: 1(0,0)
Pad_e5947
  custom 7.437x5.469 smd: 1(0,0)
Pad_e5994
  custom 2.055x1.27 smd: 65(0,0)
R0603
  rect 0.806x0.864 smd: 1(-0.753,0) 2(0.753,0)
Screw-Hole-M4
  round 4.5 hole 4: 1(0,0)
SOD-123FL_L2.8-W1.8-LS3.7-RD
  rect 1.2x1.2 smd: 1(-1.6,0) 2(1.6,0)
SOD-128_L3.8-W2.4-LS4.7-RD
  rect 1.25x2 smd: 1(-2.2,0) 2(2.2,0)
SOIC-8_L4.9-W3.9-P1.27-LS6.0-BL
  oval 0.588x2.045 smd: 1(-1.905,-2.57) 2(-0.635,-2.57) 3(0.635,-2.57) 4(1.905,-2.57) 5(1.905,2.57) 6(0.635,2.57) 7(-0.635,2.57) 8(-1.905,2.57)
SOT-23-3_L2.9-W1.3-P1.90-LS2.4-BR
  rect 1.25x0.7 smd: 1(1,-0.95) 2(1,0.95) 3(-1,0)
SW-SMD_4P-L5.1-W5.1-P3.70-LS6.5-TL_H1.5
  rect 1x0.75 smd: 1(-3,1.875) 2(3,1.875) 3(-3,-1.875) 4(3,-1.875)
Test-Point-0.5mm
  round 0.5 smd: 1(0,0)
TSSOP-28_L9.7-W4.4-P0.65-LS6.4-BL
  oval 0.343x1.732 smd: 1(-4.225,-2.866) 2(-3.575,-2.866) 3(-2.925,-2.866) 4(-2.275,-2.866) 5(-1.625,-2.866) 6(-0.975,-2.866) 7(-0.325,-2.866) 8(0.325,-2.866) 9(0.975,-2.866) 10(1.625,-2.866) 11(2.275,-2.866) 12(2.925,-2.866) 13(3.575,-2.866) 14(4.225,-2.866) 15(4.225,2.866) 16(3.575,2.866) 17(2.925,2.866) 18(2.275,2.866) 19(1.625,2.866) 20(0.975,2.866) 21(0.325,2.866) 22(-0.325,2.866) 23(-0.975,2.866) 24(-1.625,2.866) 25(-2.275,2.866) 26(-2.925,2.866) 27(-3.575,2.866) 28(-4.225,2.866)
WSON-8_L8.0-W6.10-P1.27-BL-EP
  oval 0.56x1.4 smd: 1(-1.905,-4.027) 2(-0.635,-4.027) 3(0.635,-4.027) 4(1.905,-4.027) 5(1.905,4.027) 6(0.635,4.027) 7(-0.635,4.027) 8(-1.905,4.027)
  rect 4.3x3.4 smd: 9(0,0)

## Nets
As in the schematic, except:
GND: C19.2 C20.2 C21.1 C23.1 C24.1 C25.2 C27.1 C36.1 C37.1 C38.1 C39.1 C40.1 C41.1 C42.1 C43.1 C44.1 C45.1 C46.1 C47.1 C48.1 C49.1 C50.1 CN1.2 CN4.4 CN5.3 CN6.4 CN7.4 CN8.4 CN10.3 CN11.3 D2.2 GNDTP1.1 H1.2 H1.4 H1.6 H1.8 H1.10 H1.12 H1.14 H1.16 H1.18 H1.20 H1.22 H1.24 H1.26 H1.28 H1.30 H1.32 LED2.1 NOREF#2.65 NOREF#3.1 Q1.2 R11.1 R12.1 R13.1 R14.1 SCREW1.1 SCREW2.1 SCREW3.1 SCREW4.1 SW1.3 SW1.4 U1.1 U1.2 U1.3 U1.4 U1.5 U1.14 U1.23 U1.24 U5.2 U5.4 U7.12 U7.18 U7.63 U8.3 U9.3 U10.4 U10.9 U12.3 U12.7 U20.1 U20.2 U20.3 U20.4 U20.7
V_SERVO: D1.1 NOREF.1

Pads without a net: U1 25; U7 2 3 4 8 9 10 11 20 27 37 38 39 42 43 44 45 53 54; U12 4

## Via types
v1: diameter 0.61, hole 0.305, Top Layer to Bottom Layer, 328 vias

## Routing (per net, layer and track width the routed paths; a pad name or vN(x,y) marks a point on that pad's centre or on a via; arc(x,y) is an arc through that point)
+3V3: length 394.2
  Top Layer w0.254: U7.48 35.34,33.21 33.27,33.21 ; C38.2 C39.2 37.85,44.22 38.15,43.91 U7.32 ; U10.8 28.83,60.19 R25.2
  Top Layer w0.305: U7.19 44.65,45.35
  Top Layer w0.33: v1(45.34,36.96) 44.65,37.65 U7.19
  Top Layer w0.355: R24.2 30.36,47.75 v1(26.66,51.45) 25.4,52.71 25.4,56.5 C21.2 27.79,58.89 U10.8 ; U7.1 47.6,33 48.19,32.41 46.04,32.41 45.77,32.15 ; 51.25,31.5 57.91,31.5 59.69,29.72 59.69,21.97 56.96,19.24 C46.2 50.98,19.83 U1.28 ; 51.25,31.5 C41.2 ; 51.25,31.5 52.64,30.1 ; 45.08,27.8 45.12,27.85 47.91,27.85 50.17,30.1 52.64,30.1 ; C42.2 47.75,46.59 U9.1 47.75,56.64 42.55,61.85 42.55,65.02 39.88,67.69 39.88,72.26 40.64,73.03 49.91,73.03 51.47,71.47 51.47,50 52.66,48.81 53.03,48.81 ; U20.8 55.6,22.2 55.88,22.48 55.88,23.64 C25.1 57.93,23.77 58.55,24.38 58.55,27.05 55.5,30.1 52.64,30.1
  Top Layer w0.381: U7.1 46.68,34.1 45.34,35.43 v1(45.34,36.96) ; C38.2 31.44,47.64 R24.2
  Top Layer w0.508: C42.2 46.61,45.53 C27.2 44.65,45.35 ; 32.09,30.91 32.09,26.01 ; 34.42,24.98 33.11,24.98 32.08,26.01 ; 29.21,31.05 29.21,33.62 30.73,35.14 ; 29.21,31.05 29.21,23.79 28.56,23.14 28.53,23.14 C43.2 ; 29.21,31.05 29.02,30.86 21.59,30.86 19.18,33.27 v1(19.18,45.97) ; 31.55,36.81 R21.2 ; R20.2 30.73,35.99 30.73,35.14 ; 32.1,30.95 32.1,33.15 ; 30.73,35.14 30.73,33.91 31.43,33.21 33.27,33.21 ; 48.19,32.41 50.25,32.41 C41.2
  Top Layer w1.016: R10.2 19.39,22.95 19.95,23.51 22.13,23.51 C19.1
  Bottom Layer w0.254: 26.58,51.51 26.49,51.42
  Bottom Layer w0.355: v1(45.34,36.96) 45.34,36.84 44.98,36.48 41.17,36.48 39.52,38.13 37.74,38.13 36.92,38.96 36.92,44.06 36.77,44.21 35.78,44.21
  Bottom Layer w0.381: 22.52,71.81 22.35,71.64 24.77,73.99 34.34,73.99 36.67,71.66
  Bottom Layer w0.508: 25.98,51.45 v1(26.66,51.45) ; 25.98,51.45 26.08,51.55 20.95,56.68 20.95,70.24 22.35,71.64 ; 25.98,51.45 22.49,51.45 19.18,48.13 v1(19.18,45.97) ; 19.17,34.96 17.89,33.68 4.98,33.68 4.8,33.5 4.8,33.44 3.55,32.19 ; 72.48,51.41 72.48,51.22 70.83,49.57 66.65,49.57 64.16,47.07 64.13,20.82 57.78,14.48 44.96,14.48 U8.1
  vias: v1(19.2,34.93) v1(35.81,44.22)
GND: length 183.9
  Top Layer w0.254: 21.97,36.4 22.73,36.4 23.24,35.88 ; v1(47.13,31) 47.15,30.98 v1(49.31,30.98) ; 49.29,31 v1(49.31,30.98) ; v1(49.31,30.98) 49.31,31.04 49.2,31.15 ; v1(49.31,30.98) 50.27,30.98 ; 54.62,32.51 54.55,32.45 53.81,32.45 ; 51.21,36.49 50.71,36 v1(49.98,36) ; v1(44.85,48.09) 44.85,47.06 44.94,46.98 ; v1(23.24,39.65) 22.82,40.07 R12.1 ; U1.5 U1.4 U1.3 U1.2 U1.1 ; v1(36.7,32.26) 36.26,31.81 C44.1 C45.1 ; 27.95,24.78 27.89,24.71 27.89,23.82 ; 52.48,17.82 51.53,17.82 ; H1.30 29.63,2.45 GNDTP1.1 ; U7.12 49.33,39.6 v1(49.56,39.37) ; 21.97,32.75 22.93,32.75 23.28,33.1 ; C39.1 37.78,45.62 v1(37.86,45.54) ; 46.64,46.87 46.64,46.88 v1(46.64,48.38) ; C21.1 30.08,55.52 30.23,55.36 ; 31.83,33.98 31.74,33.98 31.74,35.02 ; 52.66,20.61 52.66,22.1 52.68,22.12 ; v1(22.86,43.89) 22.41,43.44 21.97,43.44 ; 19.47,13.13 18.65,13.94 18.65,15.04 ; 51.56,17.79 51,17.23 U1.24 U1.23 ; 26.45,54.11 26.45,55.44 26.48,55.48 ; 60.75,43.58 60.75,45.33 v1(60.76,45.34) ; 56.04,34.71 56.04,35.4 55.77,35.67 ; U1.14 v1(43.43,10.67) ; 33.25,30.71 33.25,31.72 33.25,31.72 ; 46.47,44.41 46.22,44.66 45.36,44.66 45.15,44.45 U7.18 ; 57.89,49.63 59.25,49.63 ; 58.54,44.5 58.93,44.11 58.93,42.84 ; 51.68,43.3 52.61,44.23 52.61,44.66 ; 54.65,34.29 53.84,34.29 53.43,34.7 ; C37.1 v1(35.83,47.5)
  Top Layer w0.305: U7.63 45.15,31.31 45.97,30.48 46.61,30.48 v1(47.13,31)
  Top Layer w0.355: 55.47,27.55 55.47,27.37 55.28,27.18 ; C25.2 56.01,26.42 55.24,27.18 53.98,27.18 53.98,27.19
  Top Layer w0.508: U12.3 15.18,22.32 C23.1
  Top Layer w1.016: CN1.2 20.32,4.57 22.61,2.29 29.63,2.29 29.76,2.41 64.36,2.41 64.47,2.53 H1.2 ; 20.45,15.37 20.45,15.06 D2.2 ; 18.65,15.01 19.71,15.01 20.45,15.75 20.45,17.46 LED2.1
  Bottom Layer w0.254: 46.45,44.32 44.45,42.31 42.3,42.31 ; CN6.4 16.06,24.57 ; 16.06,24.57 16.19,24.57 26.67,35.05 30.26,35.05 31.27,34.05 ; 16.06,24.57 12.32,20.83 3.94,20.83 1.78,18.67 1.78,14.48 CN11.3 ; 31.29,34.06 31.92,34.06 31.94,34.03
  Bottom Layer w0.381: 41.9,37.58 41.57,37.58 40.81,38.34
  Bottom Layer w0.508: 41.81,39.29 41.89,39.37 41.89,39.38 41.92,39.34 41.92,37.61
  vias: v1(3.53,73.38) v1(3.53,67.03) v1(3.53,63.86) v1(3.53,60.68) v1(3.53,51.16) v1(3.53,35.28) v1(3.53,22.58) v1(3.53,19.41) v1(3.53,9.88) v1(3.53,6.71) v1(5.97,27.81) v1(6.71,73.38) v1(6.71,67.03) v1(6.71,63.86) v1(6.71,60.68) v1(6.71,57.51) v1(6.71,51.16) v1(6.71,47.98) v1(6.71,41.63) v1(6.71,38.46) v1(6.71,35.28) v1(6.71,32.11) v1(6.71,25.76) v1(6.71,22.58) v1(6.71,19.41) v1(6.71,13.06) v1(6.71,9.88) v1(9.88,73.38) v1(9.88,70.21) v1(9.88,67.03) v1(9.88,63.86) v1(9.88,60.68) v1(9.88,57.51) v1(9.88,51.16) v1(9.88,47.98) v1(9.88,44.81) v1(9.88,41.63) v1(9.88,38.46) v1(9.88,35.28) v1(9.88,32.11) v1(9.88,25.76) v1(9.88,22.58) v1(9.88,19.41) v1(9.88,13.06) v1(9.88,9.88) v1(9.88,6.71) v1(9.88,3.53) v1(13.06,73.38) v1(13.06,70.21) v1(13.06,67.03) v1(13.06,63.86) v1(13.06,60.68) v1(13.06,57.51) v1(13.06,51.16) v1(13.06,47.98) v1(13.06,44.81) v1(13.06,41.63) v1(13.06,35.28) v1(13.06,32.11) v1(13.06,25.76) v1(13.06,22.58) v1(13.06,19.41) v1(13.06,13.06) v1(13.06,9.88) v1(13.06,6.71) v1(13.06,3.53) v1(13.97,37.23) v1(15.49,19.18) v1(15.49,18.54) v1(16.19,19.3) v1(16.19,18.67) v1(16.23,73.38) v1(16.23,70.21) v1(16.23,67.03) v1(16.23,63.86) v1(16.23,60.68) v1(16.23,57.51) v1(16.23,51.16) v1(16.23,47.98) v1(16.23,44.81) v1(16.23,41.63) v1(16.23,35.28) v1(16.23,32.11) v1(16.23,25.76) v1(16.23,6.71) v1(16.93,19.3) v1(16.93,18.67) v1(19.41,73.38) v1(19.41,70.21) v1(19.41,67.03) v1(19.41,63.86) v1(19.41,60.68) v1(19.41,54.33) v1(19.41,51.16) v1(19.41,25.76) v1(19.41,13.06) v1(19.41,6.71) v1(19.41,3.53) v1(22.58,70.21) v1(22.58,67.03) v1(22.58,63.86) v1(22.58,57.51) v1(22.58,25.76) v1(22.58,19.41) v1(22.58,16.23) v1(22.58,6.71) v1(22.58,3.53) v1(22.61,49.28) v1(23.24,35.86) v1(23.3,33.06) v1(24,36.58) v1(24.13,46.36) v1(24.32,31.95) v1(25.53,24.51) v1(25.76,70.21) v1(25.76,67.03) v1(25.76,63.86) v1(25.76,44.81) v1(25.76,32.11) v1(25.76,22.58) v1(25.76,16.23) v1(25.76,13.06) v1(25.76,9.88) v1(26.45,54.17) v1(27.94,24.8) v1(28.93,67.03) v1(28.96,54.86) v1(28.93,44.81) v1(28.93,35.28) v1(28.93,16.23) v1(28.93,13.06) v1(29.08,36.45) v1(30.33,31.81) v1(30.68,28.21) v1(30.99,42.16) v1(30.96,24.14) v1(31.95,33.99) v1(32.11,63.86) v1(32.11,19.41) v1(32.11,16.23) v1(32.24,54.69) v1(32.64,50.88) v1(33.23,30.84) v1(34.87,45.62) v1(35.05,27.85) v1(35.28,70.21) v1(35.28,67.03) v1(35.28,63.86) v1(35.28,57.51) v1(35.28,54.33) v1(35.28,19.41) v1(35.28,9.88) v1(36.45,27.05) v1(37.35,54.14) v1(38.46,70.21) v1(38.46,67.03) v1(38.46,63.86) v1(38.46,22.58) v1(38.46,19.41) v1(38.46,13.06) v1(40.66,51.19) v1(40.8,38.4) v1(41.63,63.86) v1(41.63,60.68) v1(41.63,57.51) v1(41.63,22.58) v1(41.63,19.41) v1(42.27,42.34) v1(43.59,69.15) v1(43.59,65.97) v1(43.59,62.8) v1(44.81,57.51) v1(45.95,24.36) v1(45.97,12.57) v1(45.97,9.91) v1(46.36,17.15) v1(46.48,44.41) v1(46.76,59.62) v1(46.94,26.48) v1(46.99,15.37) v1(47.3,12.57) v1(49.13,27.54) v1(49.13,24.36) v1(49.28,9.78) v1(49.86,66.91) v1(50.34,63.93) v1(51.18,45.97) v1(51.56,10.03) v1(51.69,43.31) v1(51.79,47.87) v1(51.94,47.12) v1(52.3,24.36) v1(52.52,53.58) v1(52.54,17.82) v1(52.72,20.64) v1(53.44,68.33) v1(53.44,65.15) v1(53.44,61.98) v1(53.44,58.8) v1(53.44,55.63) v1(53.72,10.29) v1(53.93,30.77) v1(54.56,37.99) v1(54.66,34.33) v1(54.63,32.5) v1(55.24,46.86) v1(55.39,50.29) v1(55.48,27.54) v1(55.63,42.8) v1(55.77,47.69) v1(55.88,39.14) v1(56.05,34.72) v1(56.26,10.35) v1(56.52,33.02) v1(56.61,68.33) v1(56.61,65.15) v1(57.74,37.99) v1(58.36,28.88) v1(58.55,11.18) v1(58.67,63.63) v1(58.67,58.69) v1(58.67,55.72) v1(58.67,51.56) v1(58.97,42.8) v1(59.22,49.68) v1(59.56,35.94) v1(59.69,48.39) v1(60.68,19.41) v1(60.96,37.34) v1(61.13,10.8) v1(62.22,31.12) v1(62.2,28.61) v1(62.32,33.64) v1(62.37,26.12) v1(62.32,22.62) v1(63.86,19.41) v1(63.86,16.23) v1(63.86,13.06) v1(63.86,9.88) v1(67.03,73.38) v1(67.03,70.21) v1(67.03,67.03) v1(67.03,63.86) v1(67.03,60.68) v1(67.03,57.51) v1(67.03,51.16) v1(67.03,47.98) v1(67.03,44.81) v1(67.03,41.63) v1(67.03,38.46) v1(67.03,35.28) v1(67.03,32.11) v1(67.03,28.93) v1(67.03,25.76) v1(67.03,22.58) v1(67.03,19.41) v1(67.03,16.23) v1(70.21,73.38) v1(70.21,67.03) v1(70.21,63.86) v1(70.21,60.68) v1(70.21,57.51) v1(70.21,51.16) v1(70.21,47.98) v1(70.21,44.81) v1(70.21,6.71) v1(73.38,73.38) v1(73.38,67.03) v1(73.38,63.86) v1(73.38,60.68) v1(73.38,47.98) v1(73.38,44.81) v1(73.38,6.71) v1(75.4,7.61) v1(75.75,19.69)
VCC: length 5.7
  Top Layer w1.016: CN1.1 15.04,5.05 U17.1
VDDA: length 2
  Top Layer w0.254: v1(46.26,40.1) U7.13
  Bottom Layer w0.254: F1.2 46.24,40.07 v1(46.26,40.1)
BOOT0: length 7.6
  Top Layer w0.254: R22.1 40.14,27.31 42.93,30.1 43.43,30.1 43.62,30.29 43.62,32.12 U7.60
BOOT1: length 7.7
  Top Layer w0.254: U7.28 40.15,44.9 v1(40.21,44.96) ; 42.28,49.01 42.91,49.01 43.08,49.19
  Bottom Layer w0.254: v1(42.29,49.15) 41.78,49.15 40.21,47.57 v1(40.21,44.96)
FLASH_WP: length 14.9
  Top Layer w0.254: U7.25 41.65,44.71 39.75,46.61 35.81,46.61 33.15,49.28 31.46,49.28 R24.1 31.44,50.77 U10.3
HOLD: length 1.5
  Top Layer w0.254: U10.7 30.1,60.3 R25.1
HSE_IN: length 7
  Top Layer w0.254: C47.2 52.39,33.97 51.82,34.54 51.43,34.54 ; 51.27,34.54 49.91,34.54 48.36,36.1 U7.5
HSE_OUT: length 4.4
  Top Layer w0.254: 51.32,38.23 51.31,38.23 49.68,36.6 U7.6
I2C1_SCL: length 131.7
  Top Layer w0.254: U1.26 47.13,18.53 44.96,20.7 ; v1(59.06,31.25) 59.06,32.13 57.91,33.27 57.91,36.32 62.36,40.77 62.36,72.64 61.09,73.91 22.08,73.91 CN7.2 ; 44.96,20.7 42.29,23.37 42.29,28.62 43.06,29.4 43.34,29.4 44.15,30.2 U7.61 ; 44.96,20.7 50.93,20.7 51.43,21.21 51.43,22.2
  Bottom Layer w0.254: v1(59.06,31.25) 56.26,28.45 43.01,28.45 v1(42.56,28.9)
I2C1_SDA: length 143.3
  Top Layer w0.254: CN7.3 17.42,73.05 19.3,74.93 62.1,74.93 64.14,72.9 64.14,38.23 v1(59.31,33.4) ; 50.13,22.06 50,21.92 49.2,21.92 ; v1(47.24,19.69) 47.75,19.18 U1.27 ; v1(46.24,29.4) 45.08,29.4 44.64,29.84 44.64,32.14 U7.62
  Bottom Layer w0.254: v1(46.24,29.4) 55.31,29.4 v1(59.31,33.4) 60.33,32.39 60.33,21.08 58.93,19.69 v1(47.24,19.69) 47.24,21.21 48.02,21.99 v1(49.21,21.99)
I2C3_SCL: length 41.5
  Top Layer w0.254: R20.1 34.01,36.81 v1(34.64,37.43) 34.8,37.59 36.22,37.59 U7.41
  Bottom Layer w0.254: v1(34.64,37.43) 34.64,37.88 34.98,38.22 34.98,38.7 34.92,38.75 34.92,44.85 38.99,48.91 38.99,55.88 34.27,60.6 CN8.2
I2C3_SDA: length 40.8
  Top Layer w0.254: U7.40 35.06,38.1 34.7,38.46 R21.1
  Bottom Layer w0.254: CN8.3 31.75,71.61 31.75,66.17 27.81,62.23 27.81,48.39 34.39,41.81 v1(34.39,38.46)
LED_A: length 9.7
  Top Layer w0.254: U7.33 34.22,41.6 32.39,43.43 U14.2
LED_B: length 8.9
  Top Layer w0.254: U7.34 33.86,41.1 33.65,40.89 LED3.2
LED_C: length 9.6
  Top Layer w0.254: U7.35 36.2,40.58 34.99,40.58 34.67,40.26 29.42,40.26 U16.2
LED_D: length 12.1
  Top Layer w0.254: U7.36 36.22,40.09 35.51,40.09 35.09,39.67 30.95,39.67 28.63,37.36 ; 27.5,34.39 27.99,34.88 27.99,36.7 28.57,37.29
NRST: length 18.2
  Top Layer w0.254: U7.7 48.78,37.1 52.61,40.92 SW1.2 SW1.1 59.96,42.26 v1(61.66,42.26)
  Bottom Layer w0.254: R26.1 62.62,42.77 62.12,42.26 v1(61.66,42.26)
SPI1_CS: length 18.8
  Top Layer w0.254: U10.1 29.9,51.91 31.51,51.91 32.05,51.37 32.05,50.12 32.54,49.63 33.29,49.63 34.54,48.39 38.73,48.39 42.15,44.97 U7.24
SPI1_MISO: length 18.3
  Top Layer w0.254: v1(38.15,49.87) 38.92,49.1 39.03,49.1 43,45.12 43,45.02 43.15,44.87 U7.22 ; v1(30.11,49.3) 30.12,49.31 30.12,50.5 29.99,50.62
  Bottom Layer w0.254: v1(38.15,49.87) 30.34,49.87 30.11,49.64 v1(30.11,49.3)
SPI1_MOSI: length 20.3
  Top Layer w0.254: U7.23 42.65,44.98 38.88,48.74 37.45,48.74 33.4,52.79 33.4,58.13 U10.5
SPI1_SCK: length 24.9
  Top Layer w0.254: U7.21 43.65,46.01 38.35,51.31 35.94,51.31 34.04,53.21 34.04,59.44 33.53,59.94 31.88,59.94 31.37,59.44 U10.6
SWCLK: length 48.5
  Top Layer w0.254: U7.49 38.22,32.22 38.22,32.92 39.05,33.76 v1(39.05,39.69) ; CN4.2 71.86,53.21 v1(65.79,53.21)
  Bottom Layer w0.254: v1(65.79,53.21) 65.4,52.83 55.37,52.83 49.4,46.86 49.4,44.71 46.14,41.45 42.88,41.45 42.6,41.17 41.17,41.17 39.69,39.69 v1(39.05,39.69)
SWDIO: length 49.1
  Top Layer w0.254: v1(65.66,54.23) 66.42,54.99 71.14,54.99 CN4.3 ; v1(38.1,40.07) 37.97,39.94 37.97,35.69 37.38,35.1 U7.46
  Bottom Layer w0.254: v1(65.66,54.23) 55.24,54.23 48.51,47.5 48.51,44.96 45.36,41.8 42.57,41.8 42.29,41.53 40.07,41.53 38.61,40.07 v1(38.1,40.07)
TIM2_CH1: length 48.3
  Top Layer w0.254: v1(37.46,30.61) 37.59,30.48 38.1,30.48 38.65,31.03 U7.50
  Bottom Layer w0.254: CN2.1 2.48,46.93 2.29,46.74 2.29,44.07 3,43.35 6.56,43.35 10.92,38.99 28.83,38.99 33.02,34.8 33.02,33.91 36.32,30.61 v1(37.46,30.61)
TIM2_CH2: length 42.7
  Top Layer w0.254: v1(40.23,33.56) 40.39,33.4 40.6,33.4 41.15,32.85 U7.55
  Bottom Layer w0.254: CN2.2 8.27,44.43 12.45,40.26 28.7,40.26 35.4,33.56 v1(40.23,33.56)
TIM2_CH3: length 83
  Top Layer w0.254: v1(37.97,40.89) 39.65,42.57 U7.29 ; CN2.3 2.27,41.93 1.27,42.93 1.27,60.07 3.68,62.48 35.94,62.48 v1(37.21,61.21)
  Bottom Layer w0.254: v1(37.21,61.21) 39.62,58.8 39.62,42.55 v1(37.97,40.89)
TIM2_CH4: length 42.8
  Top Layer w0.254: CN2.4 9.2,39.43 18.29,48.51 28.45,48.51 34.92,42.04 38.61,42.04 39.15,42.58 U7.30
TIM3_CH1: length 50.2
  Top Layer w0.254: v1(40.89,35.05) 42.15,33.8 U7.57
  Bottom Layer w0.254: CN3.1 4.44,58.8 20.07,43.18 28.07,43.18 34.8,36.45 39.5,36.45 v1(40.89,35.05)
TIM3_CH2: length 48.4
  Top Layer w0.254: v1(40.26,34.42) 40.64,34.42 41.65,33.41 U7.56
  Bottom Layer w0.254: CN3.2 5.97,56.26 20.07,42.16 28.19,42.16 35.69,34.67 40,34.67 v1(40.26,34.42)
TIM3_CH3: length 64.9
  Top Layer w0.254: v1(43.43,54.1) 41.66,54.1 34.29,61.47 24.13,61.47 16.38,53.72 CN3.3 ; U7.26 v1(41.15,42.16)
  Bottom Layer w0.254: v1(41.15,42.16) 44.07,45.09 44.07,48.64 44.45,49.02 45.85,49.02 46.48,49.66 46.48,53.47 45.85,54.1 43.31,54.1
UART1_RX: length 49.3
  Top Layer w0.254: U7.59 43.18,32.18 43.18,31.24 v1(40.89,28.96) ; v1(23.49,28.96) 8.13,28.96 5.08,25.91 2.79,25.91 1.78,26.92 1.78,28.96 2.39,29.57 CN6.2
  Bottom Layer w0.254: v1(40.89,28.96) v1(23.49,28.96)
UART1_TX: length 41.4
  Top Layer w0.254: v1(41.05,29.94) 41.18,29.94 42.66,31.42 42.66,32.13 U7.58 ; v1(23.62,29.94) 6.68,29.94 CN6.3
  Bottom Layer w0.254: v1(41.05,29.94) v1(23.62,29.94)
UART2_RX: length 31.5
  Top Layer w0.254: U7.17 46.85,43.55 49.15,45.85 49.15,61.34 45.72,64.77 CN10.2
UART2_TX: length 31.8
  Top Layer w0.254: U7.16 50.04,44.04 50.04,62.36 48.13,64.26 48.13,71.37 CN10.1
UART3_RX: length 46
  Top Layer w0.254: v1(30.99,22.86) 34.8,22.86 35.69,23.75 35.69,27.31 36.58,28.19 37.53,28.19 39.65,30.31 U7.52
  Bottom Layer w0.254: CN11.2 14.1,14.86 14.86,15.62 17.4,15.62 19.3,17.53 25.65,17.53 v1(30.99,22.86)
UART3_TX: length 44.2
  Top Layer w0.254: v1(33.53,27.31) 36.2,29.97 38.48,29.97 39.15,30.64 U7.51
  Bottom Layer w0.254: v1(33.53,27.31) 24.96,27.31 18.45,20.8 18.45,18.78 16.08,16.42 4.92,16.42 CN11.1
UART4_RX: length 12.5
  Top Layer w0.254: Q1.3 55.94,48.81 54.54,48.81 54.54,48.04 50.93,44.42 50.93,43.72 48.3,41.1 U7.15
UART4_RX_INV: length 26.3
  Top Layer w0.254: 56.7,46.73 56.7,48.12 56.88,48.3 56.88,49.23 56.7,49.41 56.7,63.94 59.82,67.06 59.82,71.37 CN5.1
UART4_TX: length 46.7
  Top Layer w0.254: U7.14 50.25,40.6 55.12,45.47 59.05,45.47 61.01,47.42 61.01,72.46 60.33,73.15 57.78,73.15 57.15,72.52 CN5.2
$1N899: length 4.9
  Top Layer w0.254: U7.31 38.65,44.87 v1(38.86,45.09) ; 38.16,47.51 38.72,47.51 39.04,47.19
  Bottom Layer w0.254: v1(39.04,47.21) 39.16,47.08 39.16,45.39 v1(38.86,45.09)
$1N903: length 3.2
  Top Layer w0.254: C36.2 34.42,35.05 34.92,34.54 36.17,34.54 U7.47
$1N2019: length 4.7
  Top Layer w0.254: 52.82,38.23 53.55,37.5 53.55,36.41 55.27,36.41 C48.2
$1N4024: length 20
  Top Layer w0.254: U2.8 35.76,16.58 U1.6
$1N4028: length 17.2
  Top Layer w0.254: U1.7 37.65,15.93 U2.7
$1N4033: length 14.4
  Top Layer w0.254: U1.8 39.54,15.28 U2.6
$1N4038: length 11.6
  Top Layer w0.254: U2.5 41.43,14.63 U1.9
$1N4043: length 9.5
  Top Layer w0.254: U1.10 43.43,13.97 42.04,13.97 37.21,9.14 U2.4
$1N4048: length 7.6
  Top Layer w0.254: U1.11 42.41,13.33 39.88,10.8 39.88,8 U2.3
$1N4053: length 6.7
  Top Layer w0.254: U2.2 41.02,9.14 41.02,10.95 42.77,12.7 43.41,12.7 U1.12
$1N4058: length 5.3
  Top Layer w0.254: U1.13 44.36,12.03 44.83,11.56 U2.1
$1N4529: length 22.7
  Top Layer w0.254: U1.22 62.81,15.93 65.15,13.59 U3.1
$1N4533: length 19.3
  Top Layer w0.254: U1.21 59.91,15.28 62.61,12.57 U3.2
$1N4538: length 16.6
  Top Layer w0.254: U3.3 60.07,12.83 58.27,14.63 U1.20
$1N4543: length 13.3
  Top Layer w0.254: U3.4 57.53,11.94 55.49,13.98 U1.19
$1N4548: length 10.1
  Top Layer w0.254: U1.18 52.97,13.33 54.99,11.3 U3.5
$1N4553: length 7.1
  Top Layer w0.254: U1.17 50.69,12.68 52.45,10.92 U3.6
$1N4558: length 5.8
  Top Layer w0.254: U1.16 50.33,12.03 50.67,11.68 50.67,8.64 U3.7
$1N4563: length 4.2
  Top Layer w0.254: U1.15 47.37,9.58 U3.8
$1N4838: length 2
  Top Layer w0.254: v1(68.07,6.35) 68.07,5.36 VDDTP1.1
$1N9057: length 2.6
  Top Layer w0.254: R22.2 37.6,25.66 U8.2
$1N9157: length 2.8
  Top Layer w0.254: U9.2 45.21,49.92 44.76,49.47
$1N10282: length 10
  Top Layer w1.016: D2.1 19.07,9.7 U17.2 18.74,10.59 16.51,12.83 16.51,14.96 C24.2
$1N11945: length 2.7
  Top Layer w0.762: LED2.2 20.9,20.2 R10.1
$1N12544: length 3.9
  Top Layer w0.254: U14.1 23.77,44.95 21.97,44.95
$1N12570: length 3.4
  Top Layer w0.254: R12.2 24.5,41.58 LED3.1
$1N12596: length 3.4
  Top Layer w0.254: R13.2 24.93,37.96 U16.1
$1N29425: length 1.2
  Top Layer w0.254: Q1.1 57.98,46.96 58.21,46.73
$1N35593: length 3.7
  Top Layer w0.254: R14.2 25.63,34.41 25.72,34.49

## Copper pours and planes (outline as drawn; the poured copper is in the pictures)
+3V3 on Top Layer: 42.8,28.45 45.72,28.45 45.72,27.18 42.8,27.18
+3V3 on Top Layer: 23.37,23.25 28.99,23.25 28.99,19.69 23.37,19.69
+3V3 on Top Layer: 15.75,23.75 20.07,23.75 20.07,19.81 15.75,19.81
GND on Top Layer: -1.1,76.84 77,76.84 77,-0.88 -1.1,-0.88
GND on Top Layer: 49.78,28.32 54.25,28.32 54.25,26.29 49.78,26.29
GND on Bottom Layer: -1.25,76.33 76.86,76.33 76.86,-1.27 -1.25,-1.27
VDDA on Bottom Layer: 42.95,40.89 46.36,40.89 46.36,37.19 42.95,37.19
V_SERVO on Top Layer: 68.58,33.53 74.8,33.53 74.8,21.08 68.58,21.08
$1N4838 on Bottom Layer: 25.91,12.95 73.53,12.95 73.53,3.8 25.91,3.8
$1N5034 on Top Layer: 68.58,19.3 74.3,19.3 74.3,13.46 68.58,13.46
$1N10282 on Top Layer: 15.3,18.03 17.4,18.03 17.4,13.79 15.3,13.79

Small or netless copper shapes (teardrops, artwork), in the pictures only: 7 on Top Layer, 2 on Bottom Layer
